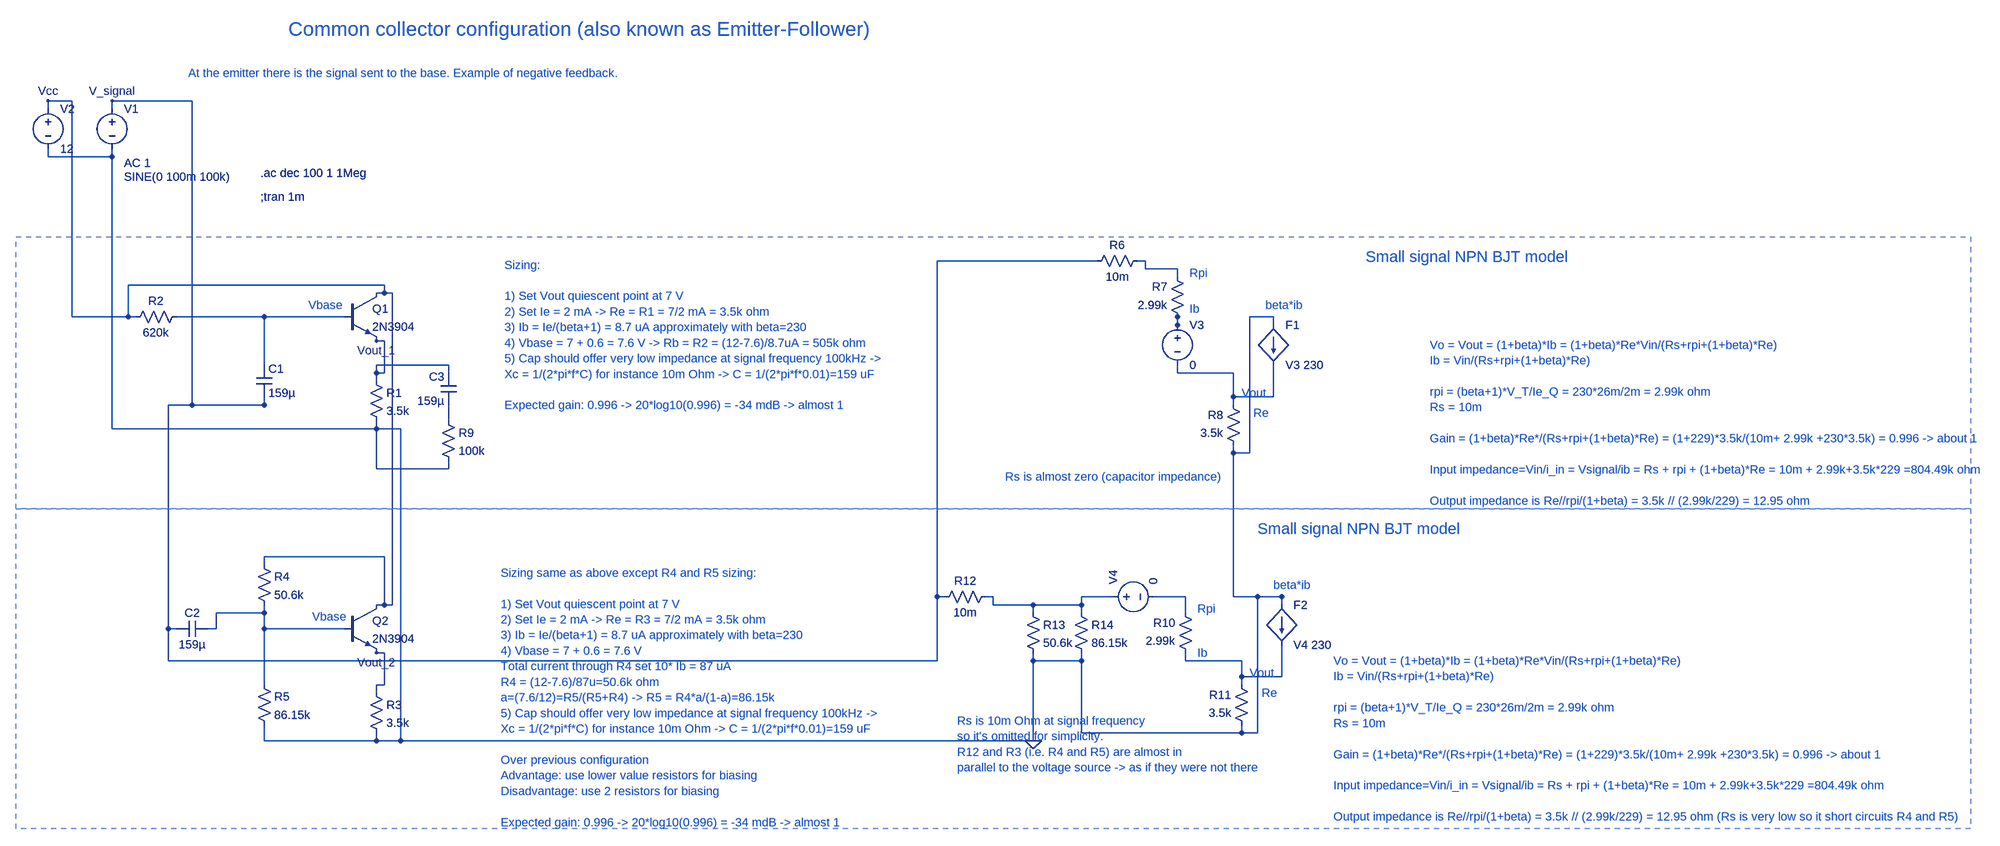
[diagram p0: schematic Common-collector-emitter-follower-amplifier.asc]
Common-collector-emitter-follower-amplifier.asc, the LTspice schematic file:
Version 4.1
SHEET 1 2556 1220
WIRE 928 192 928 176
WIRE 944 752 944 736
WIRE -864 384 -864 400
WIRE 864 992 864 1008
WIRE 448 848 448 864
WIRE 544 848 544 864
WIRE -864 1008 -864 1024
WIRE -1088 992 -1088 1008
WIRE 848 432 848 448
WIRE -720 464 -720 480
WIRE -1392 -160 -1392 -144
WIRE -1520 -160 -1520 -144
WIRE 928 176 880 176
WIRE 880 176 880 448
WIRE 880 448 848 448
WIRE 848 448 848 736
WIRE 848 736 944 736
WIRE 944 736 896 736
WIRE 896 736 896 1008
WIRE 896 1008 864 1008
WIRE 864 1008 544 1008
WIRE 544 1008 544 864
WIRE 544 864 448 864
WIRE 448 864 448 1024
WIRE 448 1024 -864 1024
WIRE -864 1024 -1088 1024
WIRE -1088 1024 -1088 1008
WIRE -864 1024 -816 1024
WIRE -816 1024 -816 400
WIRE -816 400 -864 400
WIRE -864 400 -864 480
WIRE -864 480 -720 480
WIRE -864 400 -1392 400
WIRE -1392 400 -1392 -144
WIRE -1392 -144 -1520 -144
FLAG 448 1024 0
WIRE 656 64 672 64
WIRE 736 96 736 80
WIRE 672 64 672 80
WIRE 672 80 736 80
WIRE -1088 272 -1088 256
WIRE -928 176 -944 176
WIRE -1264 176 -1248 176
WIRE -1088 256 -1088 176
WIRE -1088 176 -944 176
WIRE -1088 176 -1248 176
WIRE 736 176 736 192
WIRE 736 192 736 176
WIRE 928 272 928 288
WIRE 848 352 848 336
WIRE 736 272 736 288
WIRE 928 288 928 336
WIRE 928 336 848 336
WIRE 848 336 848 288
WIRE 848 288 736 288
WIRE -720 352 -720 368
WIRE -720 384 -720 368
WIRE 352 736 368 736
WIRE 448 768 448 752
WIRE 544 768 544 752
WIRE 608 736 592 736
WIRE 368 736 368 752
WIRE 368 752 448 752
WIRE 448 752 544 752
WIRE 544 752 544 736
WIRE 544 736 592 736
WIRE 752 768 752 752
WIRE 688 736 704 736
WIRE 752 752 752 736
WIRE 752 736 704 736
WIRE -1200 800 -1184 800
WIRE -928 800 -944 800
WIRE -1088 752 -1088 768
WIRE -1088 912 -1088 896
WIRE -1184 800 -1184 768
WIRE -1184 768 -1088 768
WIRE -1088 768 -1088 896
WIRE -1088 768 -1088 800
WIRE -1088 800 -944 800
WIRE 944 832 944 848
WIRE 752 848 752 864
WIRE 864 912 864 896
WIRE 944 848 944 896
WIRE 944 896 864 896
WIRE 864 896 864 864
WIRE 864 864 752 864
WIRE -1088 336 -1088 352
WIRE -1264 800 -1280 800
WIRE 272 736 256 736
WIRE 576 64 560 64
WIRE -1392 -240 -1392 -256
WIRE -1088 352 -1280 352
WIRE -1280 352 -1280 800
WIRE -1088 352 -1232 352
WIRE -1232 352 -1232 -256
WIRE -1232 -256 -1392 -256
WIRE -1280 800 -1280 864
WIRE -1280 864 256 864
WIRE 256 864 256 736
WIRE 256 736 256 64
WIRE 256 64 560 64
FLAG -1392 -256 V_signal
WIRE -864 128 -848 128
WIRE -864 752 -848 752
WIRE -1344 176 -1360 176
WIRE -1088 672 -1088 656
WIRE -1520 -240 -1520 -256
WIRE -848 128 -848 112
WIRE -848 112 -1360 112
WIRE -1360 112 -1360 176
WIRE -1360 176 -1472 176
WIRE -1472 176 -1472 -256
WIRE -1472 -256 -1520 -256
WIRE -848 128 -832 128
WIRE -832 128 -832 752
WIRE -832 752 -848 752
WIRE -848 752 -848 656
WIRE -848 656 -1088 656
FLAG -1520 -256 Vcc
WIRE -720 288 -720 272
WIRE -864 224 -848 224
WIRE -864 304 -864 288
WIRE -720 272 -864 272
WIRE -864 272 -864 288
WIRE -864 288 -848 288
WIRE -848 288 -848 224
FLAG -864 224 Vout_1
WIRE -864 848 -848 848
WIRE -864 928 -864 912
WIRE -848 848 -848 912
WIRE -848 912 -864 912
FLAG -864 848 Vout_2
SYMBOL npn -928 128 R0
SYMATTR InstName Q1
SYMATTR Value 2N3904
SYMBOL res -880 288 R0
SYMATTR InstName R1
SYMATTR Value 3.5k
SYMBOL voltage -1392 -256 R0
WINDOW 123 24 124 Left 2
WINDOW 39 0 0 Left 2
WINDOW 3 24 152 Left 2
SYMATTR Value2 AC 1
SYMATTR Value SINE(0 100m 100k)
SYMATTR InstName V1
SYMBOL voltage -1520 -256 R0
WINDOW 123 0 0 Left 2
WINDOW 39 0 0 Left 2
SYMATTR InstName V2
SYMATTR Value 12
SYMBOL res -1360 192 R270
WINDOW 0 32 56 VTop 2
WINDOW 3 0 56 VBottom 2
SYMATTR InstName R2
SYMATTR Value 620k
SYMBOL cap -1104 272 R0
SYMATTR InstName C1
SYMATTR Value 159µ
SYMBOL npn -928 752 R0
SYMATTR InstName Q2
SYMATTR Value 2N3904
SYMBOL res -880 912 R0
SYMATTR InstName R3
SYMATTR Value 3.5k
SYMBOL cap -1200 784 R90
WINDOW 0 0 32 VBottom 2
WINDOW 3 32 32 VTop 2
SYMATTR InstName C2
SYMATTR Value 159µ
SYMBOL res -1104 656 R0
SYMATTR InstName R4
SYMATTR Value 50.6k
SYMBOL res -1104 896 R0
SYMATTR InstName R5
SYMATTR Value 86.15k
SYMBOL res 672 48 R90
WINDOW 0 0 56 VBottom 2
WINDOW 3 32 56 VTop 2
SYMATTR InstName R6
SYMATTR Value 10m
SYMBOL res 752 192 R180
WINDOW 0 36 76 Left 2
WINDOW 3 36 40 Left 2
SYMATTR InstName R7
SYMATTR Value 2.99k
SYMBOL res 864 448 R180
WINDOW 0 36 76 Left 2
WINDOW 3 36 40 Left 2
SYMATTR InstName R8
SYMATTR Value 3.5k
SYMBOL res 768 864 R180
WINDOW 0 36 76 Left 2
WINDOW 3 36 40 Left 2
SYMATTR InstName R10
SYMATTR Value 2.99k
SYMBOL res 880 1008 R180
WINDOW 0 36 76 Left 2
WINDOW 3 36 40 Left 2
SYMATTR InstName R11
SYMATTR Value 3.5k
SYMBOL f 928 192 R0
SYMATTR InstName F1
SYMATTR Value V3 230
SYMBOL voltage 736 176 R0
WINDOW 123 0 0 Left 0
WINDOW 39 0 0 Left 0
SYMATTR InstName V3
SYMATTR Value 0
SYMBOL voltage 592 736 R270
WINDOW 123 0 0 Left 0
WINDOW 39 0 0 Left 0
SYMATTR InstName V4
SYMATTR Value 0
SYMBOL f 944 752 R0
SYMATTR InstName F2
SYMATTR Value V4 230
SYMBOL cap -704 352 R180
WINDOW 0 24 56 Left 2
WINDOW 3 24 8 Left 2
SYMATTR InstName C3
SYMATTR Value 159µ
SYMBOL res -736 368 R0
SYMATTR InstName R9
SYMATTR Value 100k
SYMBOL res 368 720 R90
WINDOW 0 0 56 VBottom 2
WINDOW 3 32 56 VTop 2
SYMATTR InstName R12
SYMATTR Value 10m
SYMBOL res 432 752 R0
SYMATTR InstName R13
SYMATTR Value 50.6k
SYMBOL res 528 752 R0
SYMATTR InstName R14
SYMATTR Value 86.15k
TEXT -1240 -312 Left 2 ;At the emitter there is the signal sent to the base. Example of negative feedback.
TEXT -1040 -400 Left 4 ;Common collector configuration (also known as Emitter-Follower)
TEXT -608 72 Left 2 ;Sizing:\n \n1) Set Vout quiescent point at 7 V\n2) Set Ie = 2 mA -> Re = R1 = 7/2 mA = 3.5k ohm\n3) Ib = Ie/(beta+1) = 8.7 uA approximately with beta=230\n4) Vbase = 7 + 0.6 = 7.6 V -> Rb = R2 = (12-7.6)/8.7uA = 505k ohm\n5) Cap should offer very low impedance at signal frequency 100kHz ->\nXc = 1/(2*pi*f*C) for instance 10m Ohm -> C = 1/(2*pi*f*0.01)=159 uF\n \nExpected gain: 0.996 -> 20*log10(0.996) = -34 mdB -> almost 1
TEXT -1096 -112 Left 2 !.ac dec 100 1 1Meg
TEXT -616 688 Left 2 ;Sizing same as above except R4 and R5 sizing:\n \n1) Set Vout quiescent point at 7 V\n2) Set Ie = 2 mA -> Re = R3 = 7/2 mA = 3.5k ohm\n3) Ib = Ie/(beta+1) = 8.7 uA approximately with beta=230\n4) Vbase = 7 + 0.6 = 7.6 V\nTotal current through R4 set 10* Ib = 87 uA\nR4 = (12-7.6)/87u=50.6k ohm\na=(7.6/12)=R5/(R5+R4) -> R5 = R4*a/(1-a)=86.15k \n5) Cap should offer very low impedance at signal frequency 100kHz ->\nXc = 1/(2*pi*f*C) for instance 10m Ohm -> C = 1/(2*pi*f*0.01)=159 uF\n \nOver previous configuration\nAdvantage: use lower value resistors for biasing\nDisadvantage: use 2 resistors for biasing\n \nExpected gain: 0.996 -> 20*log10(0.996) = -34 mdB -> almost 1
TEXT -1000 152 Left 2 ;Vbase
TEXT -992 776 Left 2 ;Vbase
TEXT 392 496 Left 2 ;Rs is almost zero (capacitor impedance)
TEXT 760 88 Left 2 ;Rpi
TEXT 888 368 Left 2 ;Re
TEXT 912 152 Left 2 ;beta*ib
TEXT 760 160 Left 2 ;Ib
TEXT 864 328 Left 2 ;Vout
TEXT 296 984 Left 2 ;Rs is 10m Ohm at signal frequency\nso it's omitted for simplicity. \nR12 and R3 (i.e. R4 and R5) are almost in \nparallel to the voltage source -> as if they were not there
TEXT 776 760 Left 2 ;Rpi
TEXT 904 928 Left 2 ;Re
TEXT 928 712 Left 2 ;beta*ib
TEXT 776 848 Left 2 ;Ib
TEXT 880 888 Left 2 ;Vout
TEXT 1112 56 Left 3 ;Small signal NPN BJT model
TEXT 896 600 Left 3 ;Small signal NPN BJT model
TEXT 1240 232 Left 2 ;Vo = Vout = (1+beta)*Ib = (1+beta)*Re*Vin/(Rs+rpi+(1+beta)*Re)\nIb = Vin/(Rs+rpi+(1+beta)*Re)\n \nrpi = (beta+1)*V_T/Ie_Q = 230*26m/2m = 2.99k ohm\nRs = 10m\n \nGain = (1+beta)*Re*/(Rs+rpi+(1+beta)*Re) = (1+229)*3.5k/(10m+ 2.99k +230*3.5k) = 0.996 -> about 1\n \nInput impedance=Vin/i_in = Vsignal/ib = Rs + rpi + (1+beta)*Re = 10m + 2.99k+3.5k*229 =804.49k ohm\n \nOutput impedance is Re//rpi/(1+beta) = 3.5k // (2.99k/229) = 12.95 ohm
TEXT 1048 864 Left 2 ;Vo = Vout = (1+beta)*Ib = (1+beta)*Re*Vin/(Rs+rpi+(1+beta)*Re)\nIb = Vin/(Rs+rpi+(1+beta)*Re)\n \nrpi = (beta+1)*V_T/Ie_Q = 230*26m/2m = 2.99k ohm\nRs = 10m\n \nGain = (1+beta)*Re*/(Rs+rpi+(1+beta)*Re) = (1+229)*3.5k/(10m+ 2.99k +230*3.5k) = 0.996 -> about 1\n \nInput impedance=Vin/i_in = Vsignal/ib = Rs + rpi + (1+beta)*Re = 10m + 2.99k+3.5k*229 =804.49k ohm\n \nOutput impedance is Re//rpi/(1+beta) = 3.5k // (2.99k/229) = 12.95 ohm (Rs is very low so it short circuits R4 and R5)
TEXT -1096 -64 Left 2 !;tran 1m
RECTANGLE Normal 2320 560 -1584 16 2
RECTANGLE Normal 2320 1200 -1584 560 2

The netlist it stands for:
* Common-collector-emitter-follower-amplifier.asc
Q1 Vcc N002 Vout_1 0 2N3904
R1 Vout_1 0 3.5k
V1 V_signal 0 SINE(0 100m 100k) AC 1
V2 Vcc 0 12
R2 Vcc N002 620k
C1 N002 V_signal 159µ
Q2 Vcc N008 Vout_2 0 2N3904
R3 Vout_2 0 3.5k
C2 N008 V_signal 159µ
R4 Vcc N008 50.6k
R5 N008 0 86.15k
R6 N001 V_signal 10m
R7 N003 N001 2.99k
R8 0 N004 3.5k
R10 N009 N007 2.99k
R11 0 N009 3.5k
F1 0 N004 V3 230
V3 N003 N004 0
V4 N006 N007 0
F2 0 N009 V4 230
C3 N005 Vout_1 159µ
R9 N005 0 100k
R12 N006 V_signal 10m
R13 N006 0 50.6k
R14 N006 0 86.15k
.model NPN NPN
.model PNP PNP
.lib standard.bjt
* At the emitter there is the signal sent to the base. Example of negative feedback.
* Common collector configuration (also known as Emitter-Follower)
* Sizing:
* 1) Set Vout quiescent point at 7 V
* 2) Set Ie = 2 mA -> Re = R1 = 7/2 mA = 3.5k ohm
* 3) Ib = Ie/(beta+1) = 8.7 uA approximately with beta=230
* 4) Vbase = 7 + 0.6 = 7.6 V -> Rb = R2 = (12-7.6)/8.7uA = 505k ohm
* 5) Cap should offer very low impedance at signal frequency 100kHz ->
* Xc = 1/(2*pi*f*C) for instance 10m Ohm -> C = 1/(2*pi*f*0.01)=159 uF
* Expected gain: 0.996 -> 20*log10(0.996) = -34 mdB -> almost 1
.ac dec 100 1 1Meg
* Sizing same as above except R4 and R5 sizing:
* 1) Set Vout quiescent point at 7 V
* 2) Set Ie = 2 mA -> Re = R3 = 7/2 mA = 3.5k ohm
* 3) Ib = Ie/(beta+1) = 8.7 uA approximately with beta=230
* 4) Vbase = 7 + 0.6 = 7.6 V
* Total current through R4 set 10* Ib = 87 uA
* R4 = (12-7.6)/87u=50.6k ohm
* a=(7.6/12)=R5/(R5+R4) -> R5 = R4*a/(1-a)=86.15k
* 5) Cap should offer very low impedance at signal frequency 100kHz ->
* Xc = 1/(2*pi*f*C) for instance 10m Ohm -> C = 1/(2*pi*f*0.01)=159 uF
* Over previous configuration
* Advantage: use lower value resistors for biasing
* Disadvantage: use 2 resistors for biasing
* Expected gain: 0.996 -> 20*log10(0.996) = -34 mdB -> almost 1
* Vbase
* Vbase
* Rs is almost zero (capacitor impedance)
* Rpi
* Re
* beta*ib
* Ib
* Vout
* Rs is 10m Ohm at signal frequency
* so it's omitted for simplicity.
* R12 and R3 (i.e. R4 and R5) are almost in
* parallel to the voltage source -> as if they were not there
* Rpi
* Re
* beta*ib
* Ib
* Vout
* Small signal NPN BJT model
* Small signal NPN BJT model
* Vo = Vout = (1+beta)*Ib = (1+beta)*Re*Vin/(Rs+rpi+(1+beta)*Re)
* Ib = Vin/(Rs+rpi+(1+beta)*Re)
* rpi = (beta+1)*V_T/Ie_Q = 230*26m/2m = 2.99k ohm
* Rs = 10m
* Gain = (1+beta)*Re*/(Rs+rpi+(1+beta)*Re) = (1+229)*3.5k/(10m+ 2.99k +230*3.5k) = 0.996 -> about 1
* Input impedance=Vin/i_in = Vsignal/ib = Rs + rpi + (1+beta)*Re = 10m + 2.99k+3.5k*229 =804.49k ohm
* Output impedance is Re//rpi/(1+beta) = 3.5k // (2.99k/229) = 12.95 ohm
* Vo = Vout = (1+beta)*Ib = (1+beta)*Re*Vin/(Rs+rpi+(1+beta)*Re)
* Ib = Vin/(Rs+rpi+(1+beta)*Re)
* rpi = (beta+1)*V_T/Ie_Q = 230*26m/2m = 2.99k ohm
* Rs = 10m
* Gain = (1+beta)*Re*/(Rs+rpi+(1+beta)*Re) = (1+229)*3.5k/(10m+ 2.99k +230*3.5k) = 0.996 -> about 1
* Input impedance=Vin/i_in = Vsignal/ib = Rs + rpi + (1+beta)*Re = 10m + 2.99k+3.5k*229 =804.49k ohm
* Output impedance is Re//rpi/(1+beta) = 3.5k // (2.99k/229) = 12.95 ohm (Rs is very low so it short circuits R4 and R5)
;tran 1m
.backanno
.end